# EasyEDA Pro project ProPrj_HEMY 2.0_2025-04-23.epro, board PCB2_1
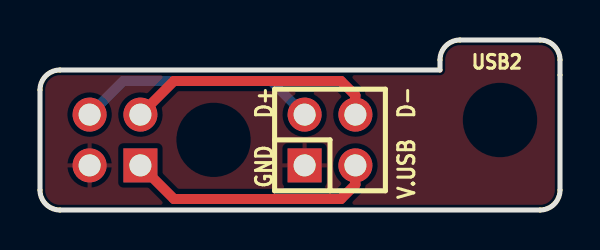
[diagram p10: board, top side]
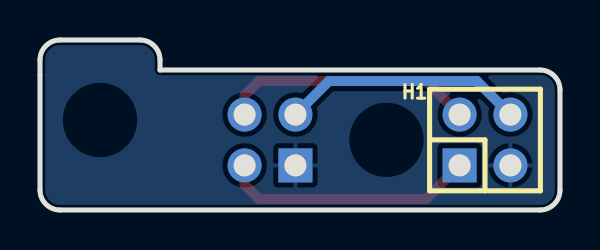
[diagram p11: board, bottom side, seen from below]

Outline 26 x 8.5 mm; copper layers: Top Layer, Bottom Layer. Coordinates in mm from the lower left corner of the outline.
Outline path: 0,6 arc(0.29,6.71) 1,7 20,7 20,7.5 arc(20.29,8.21) 21,8.5 25,8.5 arc(25.71,8.21) 26,7.5 26,1 arc(25.71,0.29) 25,0 1,0 arc(0.29,0.29) 0,1 0,6
Stack: Top Layer 0.035mm / Dielectric1 1.51mm FR4 er 4.5 / Bottom Layer 0.035mm

## Design rules (mm)
template: JLCPCB Capability(Two Layers Board)
spacing copperThickness1oz (default): track to track 0.102, other pairs 0.152 to 0.3
spacing copperThickness2oz: track to track 0.203, other pairs 0.152 to 0.3
track width copperThickness1oz (default): min 0.127, default 0.254, max 2.54
track width copperThickness2oz: min 0.203, default 0.254, max 2.54
differential pair differentialPair (default): width min 0.127, default 0.254, max 2.54; gap min 0.152, default 0.152
via viaSize (default): diameter min 0.5, default 0.61, max 10; hole min 0.3, default 0.305, max 6.3

## Placement (name value [footprint] x y rotation side)
H1  PZ254V-12-4P  [HDR-TH_4P-P2.54-V-M-R2-C2-S2.54]  3.75 3.5 180 bottom
USB2  PZ254V-12-4P  [HDR-TH_4P-P2.54-V-M-R2-C2-S2.54]  14.5 3.5 0 top

## Footprints (pads in the part's own frame, mm; a bottom-side part is the same pattern mirrored in y, then rotated)
HDR-TH_4P-P2.54-V-M-R2-C2-S2.54
  rect 1.7x1.7 hole 1.1: 1(-1.27,-1.27)
  round 1.7 hole 1.1: 2(-1.27,1.27) 3(1.27,-1.27) 4(1.27,1.27)

## Nets
As in the schematic.

## Routing (per net, layer and track width the routed paths; a pad name or vN(x,y) marks a point on that pad's centre or on a via; arc(x,y) is an arc through that point)
$1N537: length 12.1
  Bottom Layer w0.5: USB2.2 11.55,6.45 4.16,6.45 H1.4
$1N559: length 12.7
  Top Layer w0.5: H1.2 6.7,6.45 15.05,6.45 15.77,5.73 USB2.4
$1N563: length 12.7
  Top Layer w0.5: USB2.3 15.77,1.27 15.05,0.55 6.7,0.55 H1.1

## Copper pours and planes (outline as drawn; the poured copper is in the pictures)
GND on Top Layer: -3,10.5 35,10.5 35,-50.5 -3,-50.5
GND on Bottom Layer: -3,12.5 35,12.5 35,-48.5 -3,-48.5

## Text on the board
Top Silkscreen Layer: D+ | GND | D- | V.USB
